# Altium schematic sheet schematic.SchDoc
size A3; ENG_APP_DATE: --/--/--; DSN_APP_DATE: --/--/--; CHK_APP_DATE: --/--/--; DocumentNumber: 1; Revision: 1.0; SheetNumber: 1; SheetTotal: 1
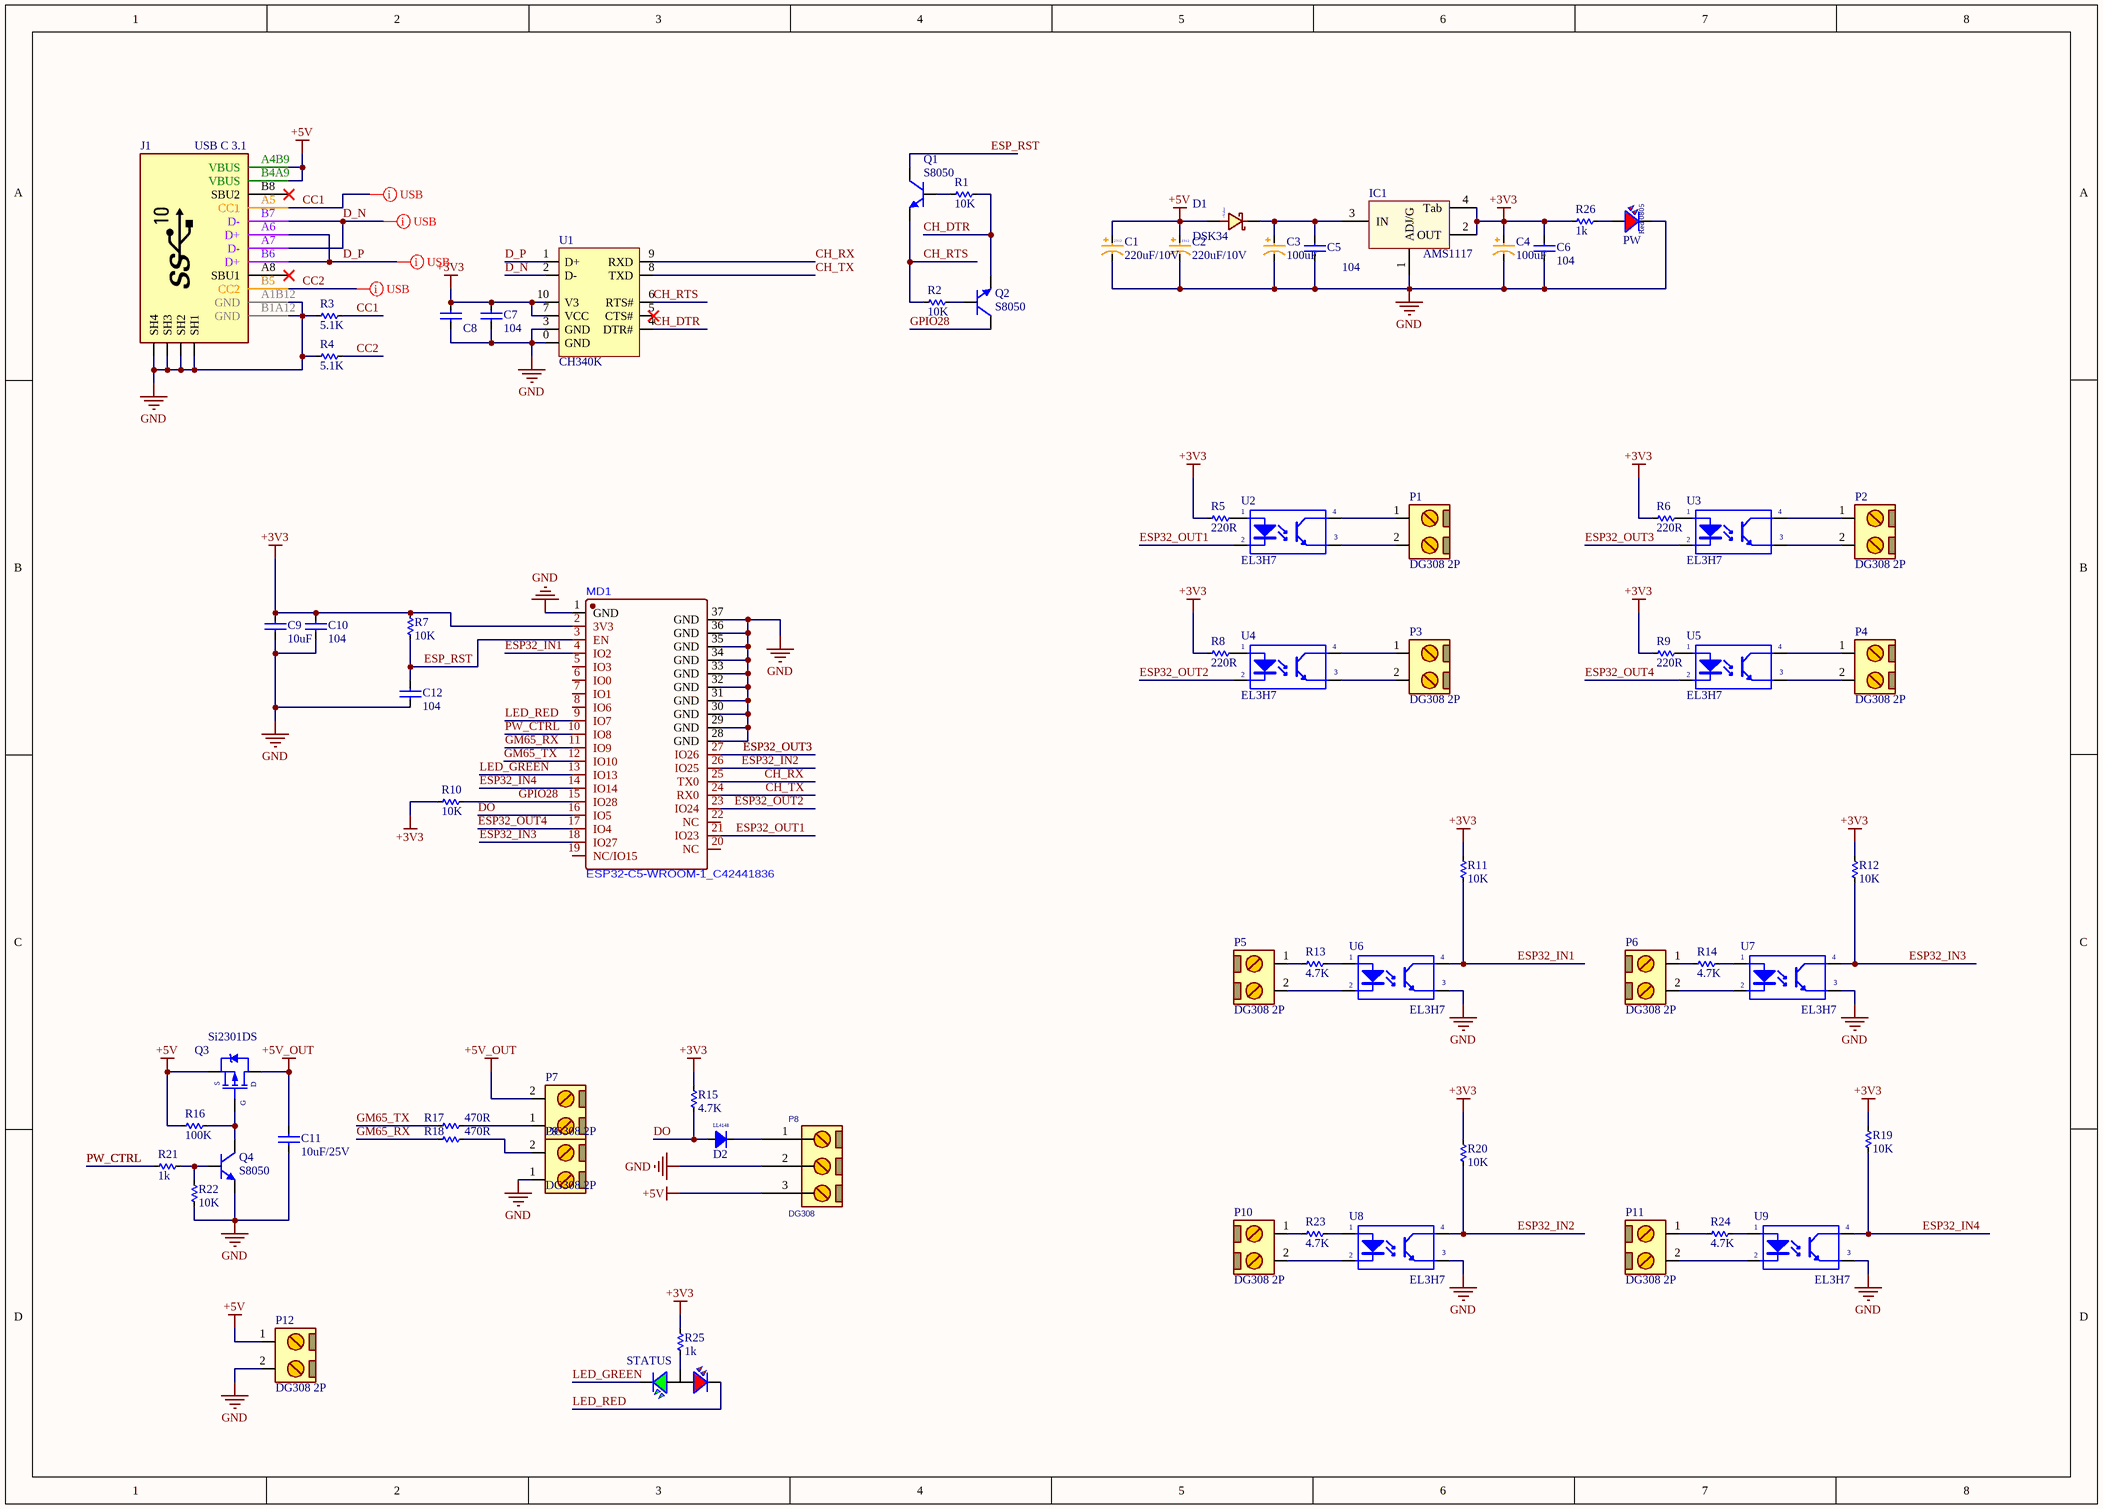
[diagram p0: schematic.SchDoc]

## Parts
C1  220uF/10V  [C_tantalum_6032-2312]
C2  220uF/10V  [C_tantalum_6032-2312]
C3  100uF  [C_TANTALUM_3528_1210]
C4  100uF  [C_TANTALUM_3528_1210]
C5  104  [C_0805_SMD]
C6  104  [C_0805_SMD]
C7  104  [C_0805_SMD]
C8  10uF/25V  [C_0805_SMD]  (value not drawn)
C9  10uF  [C1206]
C10  104  [C_0805_SMD]
C11  10uF/25V  [C_0805_SMD]
C12  104  [C_0805_SMD]
D1  DSK34  [D_SOD123W]
D2  LL4148  [SOD80C_MFG]  (value not drawn)
IC1  AMS1117  [SOT223-4N]
J1  USB C 3.1  [USBC_SMD_16_USB4105 PAD L]
MD1  ESP32-C5-WROOM-1_C42441836  [COMM-SMD_37P-P1.27-L27.5-W18.0-ESP32-C5-WROOM-1]
P1  DG308 2P  [DG308 KF120 2.54mm 2P - duplicate]
P2  DG308 2P  [DG308 KF120 2.54mm 2P - duplicate]
P3  DG308 2P  [DG308 KF120 2.54mm 2P - duplicate]
P4  DG308 2P  [DG308 KF120 2.54mm 2P - duplicate]
P5  DG308 2P  [DG308 KF120 2.54mm 2P - duplicate]
P6  DG308 2P  [DG308 KF120 2.54mm 2P - duplicate]
P7  DG308 2P  [DG308 KF120 2.54mm 2P - duplicate]
P8  DG308  [DG308 KF120 2.54mm 3P]
P9  DG308 2P  [DG308 KF120 2.54mm 2P - duplicate]
P10  DG308 2P  [DG308 KF120 2.54mm 2P - duplicate]
P11  DG308 2P  [DG308 KF120 2.54mm 2P - duplicate]
P12  DG308 2P  [DG308 KF120 2.54mm 2P - duplicate]
PW  LED RED  [LED 0805 Red]  (value not drawn)
Q1  S8050  [SOT23_N NXP]
Q2  S8050  [SOT23_N NXP]
Q3  Si2301DS  [SOT23_N NXP]
Q4  S8050  [SOT23_N NXP]
R1  10K  [RES-SMD-0805]
R2  10K  [RES-SMD-0805]
R3  5.1K  [RES-SMD-0805]
R4  5.1K  [RES-SMD-0805]
R5  220R  [RES-SMD-0805]
R6  220R  [RES-SMD-0805]
R7  10K  [RES-SMD-0805]
R8  220R  [RES-SMD-0805]
R9  220R  [RES-SMD-0805]
R10  10K  [RES-SMD-0805]
R11  10K  [RES-SMD-0805]
R12  10K  [RES-SMD-0805]
R13  4.7K  [RES-SMD-1206]
R14  4.7K  [RES-SMD-1206]
R15  4.7K  [RES-SMD-0805]
R16  100K  [RES-SMD-0805]
R17  470R  [RES-SMD-0805]
R18  470R  [RES-SMD-0805]
R19  10K  [RES-SMD-0805]
R20  10K  [RES-SMD-0805]
R21  1k  [RES-SMD-0805]
R22  10K  [RES-SMD-0805]
R23  4.7K  [RES-SMD-1206]
R24  4.7K  [RES-SMD-1206]
R25  1k  [RES-SMD-0805]
R26  1k  [RES-SMD-0805]
STATUS  Led R-G  [Led_3mm_3_Pin_CA]  (value not drawn)
U1  CH340K  [SSOP10 / ESSOP-10]
U2  EL3H7  [SO_4-EL3H7-G_MFG]
U3  EL3H7  [SO_4-EL3H7-G_MFG]
U4  EL3H7  [SO_4-EL3H7-G_MFG]
U5  EL3H7  [SO_4-EL3H7-G_MFG]
U6  EL3H7  [SO_4-EL3H7-G_MFG]
U7  EL3H7  [SO_4-EL3H7-G_MFG]
U8  EL3H7  [SO_4-EL3H7-G_MFG]
U9  EL3H7  [SO_4-EL3H7-G_MFG]

## Nets
+3V3: C4.1 C6.2 C7.2 C8.2 C9.2 C10.2 IC1.2(OUT) IC1.4(Tab) MD1.2(3V3) R5.2 R6.2 R7.1 R8.2 R9.2 R10.1 R11.1 R12.1 R15.1 R19.1 R20.1 R25.1 R26.1 U1.7(VCC) U1.10(V3)
+5V: C1.1 C2.1 D1.1(A) J1.A4B9(VBUS) J1.B4A9(VBUS) P8.3 P12.1 Q3.2(S) R16.1
+5V_OUT: C11.2 P7.2 Q3.3(D)
GND: C1.2 C2.2 C3.2 C4.2 C5.1 C6.1 C7.1 C8.1 C9.1 C10.1 C11.1 C12.1 IC1.1(ADJ/G) J1.A1B12(GND) J1.B1A12(GND) J1.SH1 J1.SH2 J1.SH3 J1.SH4 MD1.1(GND) MD1.28(GND) MD1.29(GND) MD1.30(GND) MD1.31(GND) MD1.32(GND) MD1.33(GND) MD1.34(GND) MD1.35(GND) MD1.36(GND) MD1.37(GND) P8.2 P9.1 P12.2 PW.2 Q4.2(E) R3.2 R4.2 R22.2 U1.0(GND) U1.3(GND) U6.3(E) U7.3(E) U8.3(E) U9.3(E)
CC1: J1.A5(CC1) R3.1
CC2: J1.B5(CC2) R4.1
CH_DTR: Q2.2(E) R1.1 U1.4(DTR#)
CH_RTS: Q1.2(E) R2.2 U1.6(RTS#)
CH_RX: MD1.25(TX0) U1.9(RXD)
CH_TX: MD1.24(RX0) U1.8(TXD)
D_N: J1.A7(D-) J1.B7(D-) U1.2(D-)
D_P: J1.A6(D+) J1.B6(D+) U1.1(D+)
DO: D2.2 MD1.16(IO5) R15.2
ESP32_IN1: MD1.4(IO2) R11.2 U6.4(C)
ESP32_IN2: MD1.26(IO25) R20.2 U8.4(C)
ESP32_IN3: MD1.18(IO27) R12.2 U7.4(C)
ESP32_IN4: MD1.14(IO14) R19.2 U9.4(C)
ESP32_OUT1: MD1.21(IO23) U2.2(K)
ESP32_OUT2: MD1.23(IO24) U4.2(K)
ESP32_OUT3: MD1.27(IO26) U3.2(K)
ESP32_OUT4: MD1.17(IO4) U5.2(K)
ESP_RST: C12.2 MD1.3(EN) Q1.3(C) R7.2
GM65_RX: MD1.11(IO9) R18.2
GM65_TX: MD1.12(IO10) R17.2
GPIO28: MD1.15(IO28) Q2.3(C) R10.2
LED_GREEN: MD1.13(IO13) STATUS.3
LED_RED: MD1.9(IO7) STATUS.1
PW_CTRL: MD1.10(IO8) R21.2
NetC3_1: C3.1 C5.2 D1.2(K) IC1.3(IN)
NetD2_1: D2.1 P8.1
NetP1_1: P1.1 U2.4(C)
NetP1_2: P1.2 U2.3(E)
NetP2_1: P2.1 U3.4(C)
NetP2_2: P2.2 U3.3(E)
NetP3_1: P3.1 U4.4(C)
NetP3_2: P3.2 U4.3(E)
NetP4_1: P4.1 U5.4(C)
NetP4_2: P4.2 U5.3(E)
NetP5_1: P5.1 R13.1
NetP5_2: P5.2 U6.2(K)
NetP6_1: P6.1 R14.2
NetP6_2: P6.2 U7.2(K)
NetP7_1: P7.1 R17.1
NetP9_2: P9.2 R18.1
NetP10_1: P10.1 R23.1
NetP10_2: P10.2 U8.2(K)
NetP11_1: P11.1 R24.2
NetP11_2: P11.2 U9.2(K)
NetPW_1: PW.1 R26.2
NetQ1_1: Q1.1(B) R1.2
NetQ2_1: Q2.1(B) R2.1
NetQ3_1: Q3.1(G) Q4.3(C) R16.2
NetQ4_1: Q4.1(B) R21.1 R22.1
NetR5_1: R5.1 U2.1(A)
NetR6_1: R6.1 U3.1(A)
NetR8_1: R8.1 U4.1(A)
NetR9_1: R9.1 U5.1(A)
NetR13_2: R13.2 U6.1(A)
NetR14_1: R14.1 U7.1(A)
NetR23_2: R23.2 U8.1(A)
NetR24_1: R24.1 U9.1(A)
NetR25_2: R25.2 STATUS.2

Not connected (* = marked no-connect by the designer): J1 A8(SBU1)* B8(SBU2)*; MD1 5(IO3) 6(IO0) 7(IO1) 8(IO6) 19(NC/IO15) 20(NC) 22(NC); U1 5(CTS#)*

## Layout directives
net class USB: CC2, D_N, D_P
mark named USB: CC1

## Notes on the sheet
- Title
- Size:
- Date:
- A4
- Number:
- Time:
- Revision:
- Sheet
- of
- File:
- (in symbol Cap Tantalum 220uF 10V 2312) 2312
- (in symbol LED 0805 RED) 0805; Red

## Library data of the parts
C1 C2 = Cap Tantalum 220uF 10V 2312: Cap SMD 2312 (6032); Code: N/A
C3 C4 = Cap Tantalum 100uF 10V 1210 (3528): Cap Tantalum SMD 1210 (3528); Code: 1419-039; Designed by: TranLuyen
C5-C7 C10 C12 = Cap 0805 104 100nF: Cap SMD 0805 104-100nF-0.1uF 50V; Code: 1438-080
C8 C11 = Cap 0805 10uF 25V: Cap SMD 0805 10uF; Code: 1436-100
C9 = Cap 1206 10uF 50V: Cap SMD 1206 105-10uF 50V; Code: N/A
D1 = DSK34-SOD-123: Surface-Mount Schottky Barrier Rectifier; Code: 2001-086
D2 = LL4148: 0.2A, 100V, SOD80; Code: 2001-012; Designed by: Nhox; Value: LL4148
IC1 = AMS1117-3.3V SOT223: SOT-223; Code: 5102-034
J1 = CONN_USBC_SMD_16_USB4105: CONN, USB, Type C, USB 2.0, Right-Angle, SMD; Code: 3518-006; Rule: UNIONINDEX=0|RULEKIND=Clearance|NETSCOPE=DifferentNets|LAYERKIND=SameLayer|NAME=Schematic Clearance Constraint|GAP=10mil|GENERICCLEARANCE=10mil|IGNOREPADTOPADCLEARANCEINFOOTPRINT=TRUE|OBJECTCLEARANCES=ClearanceObj_Arc-ClearanceObj_Arc:50000;ClearanceObj_Arc-ClearanceObj_Track:50000;ClearanceObj_Arc-ClearanceObj_SMDPad:50000;ClearanceObj_Arc-ClearanceObj_THPad:50000;ClearanceObj_Arc-ClearanceObj_Hole:0;ClearanceObj_Track-ClearanceObj_Track:50000;ClearanceObj_Track-ClearanceObj_SMDPad:50000;ClearanceObj_Track-ClearanceObj_THPad:50000;ClearanceObj_Track-ClearanceObj_Hole:0;ClearanceObj_SMDPad-ClearanceObj_SMDPad:50000;ClearanceObj_SMDPad-ClearanceObj_THPad:50000;ClearanceObj_SMDPad-ClearanceObj_Fill:50000;ClearanceObj_SMDPad-ClearanceObj_Poly:50000;ClearanceObj_SMDPad-ClearanceObj_Region:50000;ClearanceObj_SMDPad-ClearanceObj_Hole:0;ClearanceObj_THPad-ClearanceObj_Hole:0;ClearanceObj_Via-ClearanceObj_Hole:0;ClearanceObj_Fill-ClearanceObj_Hole:0;ClearanceObj_Poly-ClearanceObj_Hole:0;ClearanceObj_Region-ClearanceObj_Hole:0;ClearanceObj_Text-ClearanceObj_Hole:0|UNIT=Imperial
P1-P7 P9-P12 = DG308-KF120-2.54 2P-2.54mm: Header, 2-Pin, Medium DG308-KF120 2.54 2P 2.54mm; Designed by: TranLuyen; ComponentLink1 Description: Manufacturer; ComponentLink2 Description: Datasheet; Code: N/A; ComponentLink1URL: http://www.we-online.com; ComponentLink2URL: http://katalog.we-online.de/em/datasheet/6911031100xx.pdf
P8 = DG308-KF120-2.54 3P-2.54mm: Header, 2-Pin, Medium DG308-KF120 2.54 3P 2.54mm; Designed by: TranLuyen; Code: N/A
PW = LED 0805 RED: LED 0805 SMD RED; Code: 8600-017; Designed by: TranLuyen
Q1 Q2 Q4 = S8050 SOT-23: J3Y-NPN SMD Transistor SOT23; Code: 1701-070; Rule: UNIONINDEX=0|RULEKIND=Clearance|NETSCOPE=DifferentNets|LAYERKIND=SameLayer|NAME=Schematic Clearance Constraint|GAP=10mil|GENERICCLEARANCE=10mil|IGNOREPADTOPADCLEARANCEINFOOTPRINT=FALSE|OBJECTCLEARANCES= |UNIT=Imperial
Q3 = Si2301DS: P-Channel 1.25W, Vds = -20V, Vgs = +-8V, Vgs -4.5V Id = -2.3A, Vgs -2.5V Id = -1.9A; Code: 1901-066; Value: Si2301DS
R1 R2 R7 R10-R12 R19 R20 R22 = Res 10k 0805: Resistor SMD 0805; Code: 1024-111
R3 R4 = Res 5.1k 0805: Resistor SMD 0805; Code: 1024-104
R5 R6 R8 R9 = Res 220R 0805: Resistor SMD 0805; Code: 1025-071
R13 R14 R23 R24 = Res 4.7K 1206: Resistor SMD 1206; Code: 1031-199; Value: 4.7K
R15 = Res 4.7k 0805: Resistor SMD 0805; Code: 1024-103
R16 = Res 100k 0805: Resistor SMD 0805; Code: 1024-137
R17 R18 = Res 470R 0805: Resistor SMD 0805; Code: 1024-078; Value: 470R
R21 R25 R26 = Res 1k 0805: Resistor SMD 0805; Code: 1024-086
STATUS = LED 3mm Red Green CA 3 Pin: Code: 8001-037; Designed by: Nhox
U1 = CH340K: USB To Serial; Designed by: Nhox; Code: N/A
U2-U9 = EL3H7(C)(TA)-VG SSOP-4: Optocoupler DC-IN 1-CH Transistor DC-OUT 4-Pin SSOP T/R; Code: 2303-012; Designed by: TranLuyen; ComponentLink1Description: Datasheet; ComponentLink1URL: https://datasheet.octopart.com/EL3H7%28C%29%28TA%29-VG-Everlight-datasheet-101745741.pdf